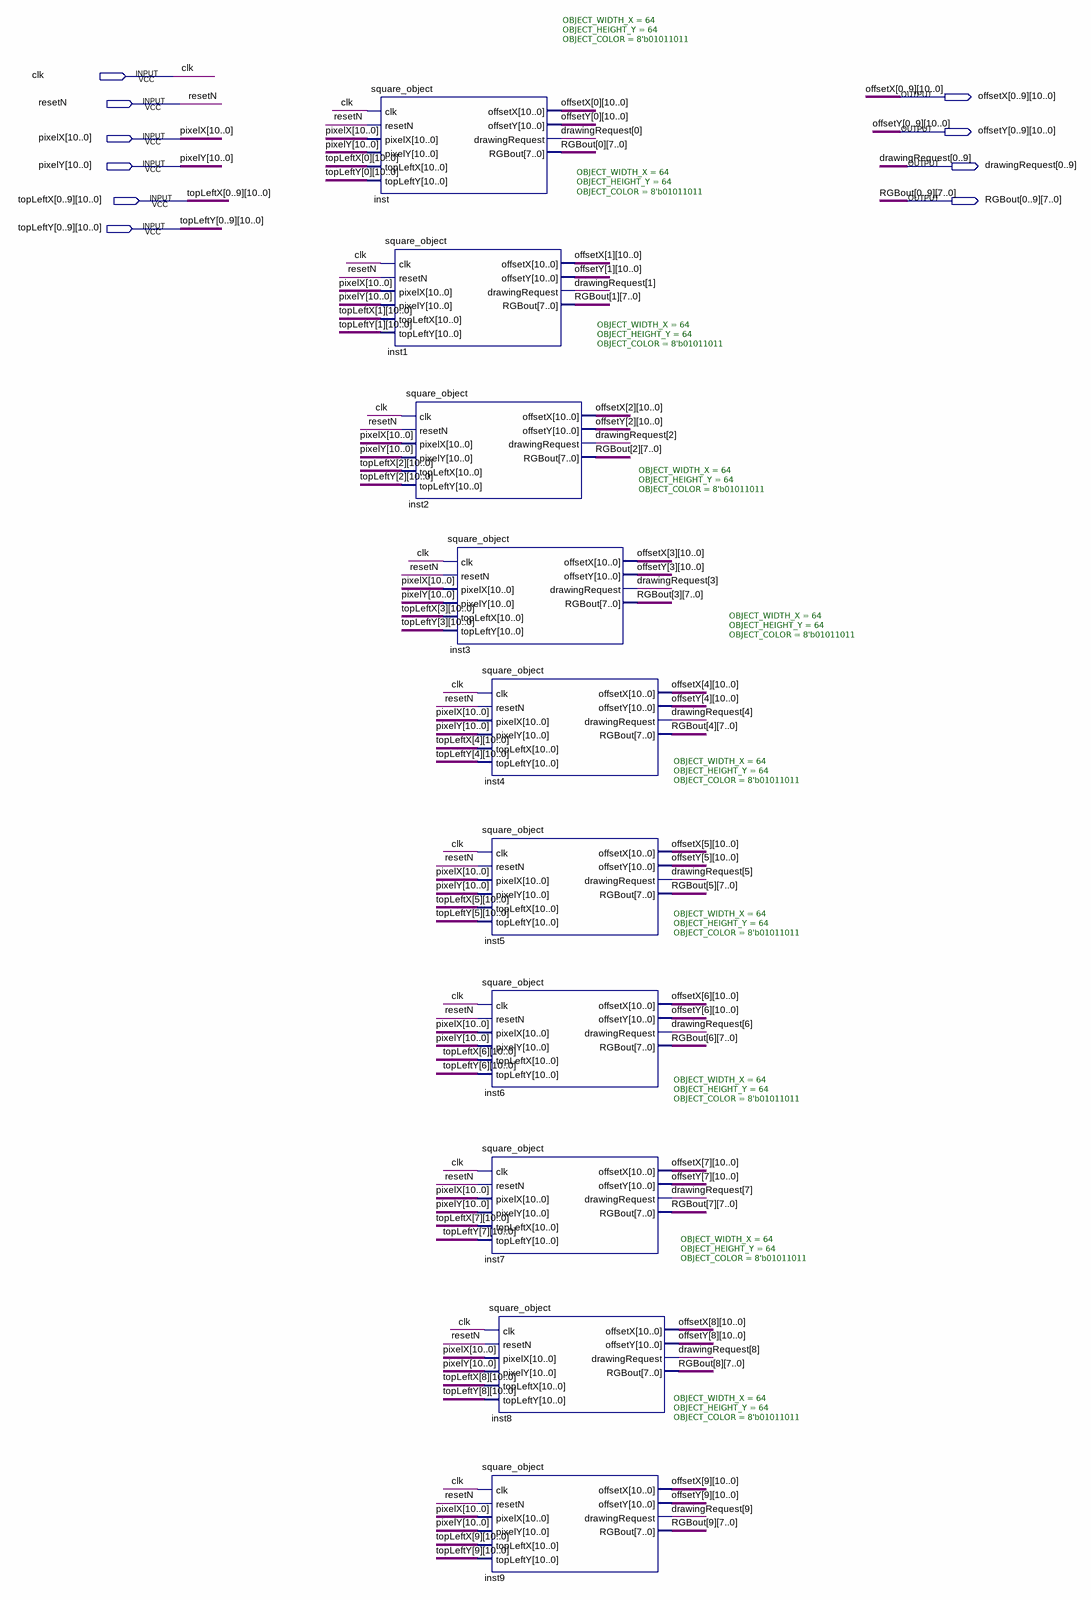
[diagram p0: schematic sheet]
// Quartus schematic 10_Square_Objects.bdf as structural Verilog: 10 symbols, 10 pins
module \10_Square_Objects  (
  input  clk,
  input  resetN,
  input  [10:0] pixelX,
  input  [10:0] pixelY,
  input  [10:0] topLeftX_0,
  input  [10:0] topLeftX_1,
  input  [10:0] topLeftX_2,
  input  [10:0] topLeftX_3,
  input  [10:0] topLeftX_4,
  input  [10:0] topLeftX_5,
  input  [10:0] topLeftX_6,
  input  [10:0] topLeftX_7,
  input  [10:0] topLeftX_8,
  input  [10:0] topLeftX_9,
  input  [10:0] topLeftY_0,
  input  [10:0] topLeftY_1,
  input  [10:0] topLeftY_2,
  input  [10:0] topLeftY_3,
  input  [10:0] topLeftY_4,
  input  [10:0] topLeftY_5,
  input  [10:0] topLeftY_6,
  input  [10:0] topLeftY_7,
  input  [10:0] topLeftY_8,
  input  [10:0] topLeftY_9,
  output [10:0] offsetX_0,
  output [10:0] offsetX_1,
  output [10:0] offsetX_2,
  output [10:0] offsetX_3,
  output [10:0] offsetX_4,
  output [10:0] offsetX_5,
  output [10:0] offsetX_6,
  output [10:0] offsetX_7,
  output [10:0] offsetX_8,
  output [10:0] offsetX_9,
  output [10:0] offsetY_0,
  output [10:0] offsetY_1,
  output [10:0] offsetY_2,
  output [10:0] offsetY_3,
  output [10:0] offsetY_4,
  output [10:0] offsetY_5,
  output [10:0] offsetY_6,
  output [10:0] offsetY_7,
  output [10:0] offsetY_8,
  output [10:0] offsetY_9,
  output [0:9] drawingRequest,
  output [7:0] RGBout_0,
  output [7:0] RGBout_1,
  output [7:0] RGBout_2,
  output [7:0] RGBout_3,
  output [7:0] RGBout_4,
  output [7:0] RGBout_5,
  output [7:0] RGBout_6,
  output [7:0] RGBout_7,
  output [7:0] RGBout_8,
  output [7:0] RGBout_9
);

  square_object #(.OBJECT_WIDTH_X(64), .OBJECT_HEIGHT_Y(64), .OBJECT_COLOR(8'b01011011)) inst (
    .clk(clk), .resetN(resetN), .pixelX(pixelX), .pixelY(pixelY), .topLeftX(topLeftX_0),
    .topLeftY(topLeftY_0), .offsetX(offsetX_0), .offsetY(offsetY_0), .drawingRequest(drawingRequest[0]),
    .RGBout(RGBout_0));
  square_object #(.OBJECT_WIDTH_X(64), .OBJECT_HEIGHT_Y(64), .OBJECT_COLOR(8'b01011011)) inst1 (
    .clk(clk), .resetN(resetN), .pixelX(pixelX), .pixelY(pixelY), .topLeftX(topLeftX_1),
    .topLeftY(topLeftY_1), .offsetX(offsetX_1), .offsetY(offsetY_1), .drawingRequest(drawingRequest[1]),
    .RGBout(RGBout_1));
  square_object #(.OBJECT_WIDTH_X(64), .OBJECT_HEIGHT_Y(64), .OBJECT_COLOR(8'b01011011)) inst2 (
    .clk(clk), .resetN(resetN), .pixelX(pixelX), .pixelY(pixelY), .topLeftX(topLeftX_2),
    .topLeftY(topLeftY_2), .offsetX(offsetX_2), .offsetY(offsetY_2), .drawingRequest(drawingRequest[2]),
    .RGBout(RGBout_2));
  square_object #(.OBJECT_WIDTH_X(64), .OBJECT_HEIGHT_Y(64), .OBJECT_COLOR(8'b01011011)) inst3 (
    .clk(clk), .resetN(resetN), .pixelX(pixelX), .pixelY(pixelY), .topLeftX(topLeftX_3),
    .topLeftY(topLeftY_3), .offsetX(offsetX_3), .offsetY(offsetY_3), .drawingRequest(drawingRequest[3]),
    .RGBout(RGBout_3));
  square_object #(.OBJECT_WIDTH_X(64), .OBJECT_HEIGHT_Y(64), .OBJECT_COLOR(8'b01011011)) inst4 (
    .clk(clk), .resetN(resetN), .pixelX(pixelX), .pixelY(pixelY), .topLeftX(topLeftX_4),
    .topLeftY(topLeftY_4), .offsetX(offsetX_4), .offsetY(offsetY_4), .drawingRequest(drawingRequest[4]),
    .RGBout(RGBout_4));
  square_object #(.OBJECT_WIDTH_X(64), .OBJECT_HEIGHT_Y(64), .OBJECT_COLOR(8'b01011011)) inst5 (
    .clk(clk), .resetN(resetN), .pixelX(pixelX), .pixelY(pixelY), .topLeftX(topLeftX_5),
    .topLeftY(topLeftY_5), .offsetX(offsetX_5), .offsetY(offsetY_5), .drawingRequest(drawingRequest[5]),
    .RGBout(RGBout_5));
  square_object #(.OBJECT_WIDTH_X(64), .OBJECT_HEIGHT_Y(64), .OBJECT_COLOR(8'b01011011)) inst6 (
    .clk(clk), .resetN(resetN), .pixelX(pixelX), .pixelY(pixelY), .topLeftX(topLeftX_6),
    .topLeftY(topLeftY_6), .offsetX(offsetX_6), .offsetY(offsetY_6), .drawingRequest(drawingRequest[6]),
    .RGBout(RGBout_6));
  square_object #(.OBJECT_WIDTH_X(64), .OBJECT_HEIGHT_Y(64), .OBJECT_COLOR(8'b01011011)) inst7 (
    .clk(clk), .resetN(resetN), .pixelX(pixelX), .pixelY(pixelY), .topLeftX(topLeftX_7),
    .topLeftY(topLeftY_7), .offsetX(offsetX_7), .offsetY(offsetY_7), .drawingRequest(drawingRequest[7]),
    .RGBout(RGBout_7));
  square_object #(.OBJECT_WIDTH_X(64), .OBJECT_HEIGHT_Y(64), .OBJECT_COLOR(8'b01011011)) inst8 (
    .clk(clk), .resetN(resetN), .pixelX(pixelX), .pixelY(pixelY), .topLeftX(topLeftX_8),
    .topLeftY(topLeftY_8), .offsetX(offsetX_8), .offsetY(offsetY_8), .drawingRequest(drawingRequest[8]),
    .RGBout(RGBout_8));
  square_object #(.OBJECT_WIDTH_X(64), .OBJECT_HEIGHT_Y(64), .OBJECT_COLOR(8'b01011011)) inst9 (
    .clk(clk), .resetN(resetN), .pixelX(pixelX), .pixelY(pixelY), .topLeftX(topLeftX_9),
    .topLeftY(topLeftY_9), .offsetX(offsetX_9), .offsetY(offsetY_9), .drawingRequest(drawingRequest[9]),
    .RGBout(RGBout_9));
endmodule
